# Altium schematic sheet HDMI_Input.SchDoc: LVDS<>SPI Interface
size Letter; Revision: 1; SheetNumber: 2; SheetTotal: 3; Client: Facebook; LeaflabsProject: Sawyer
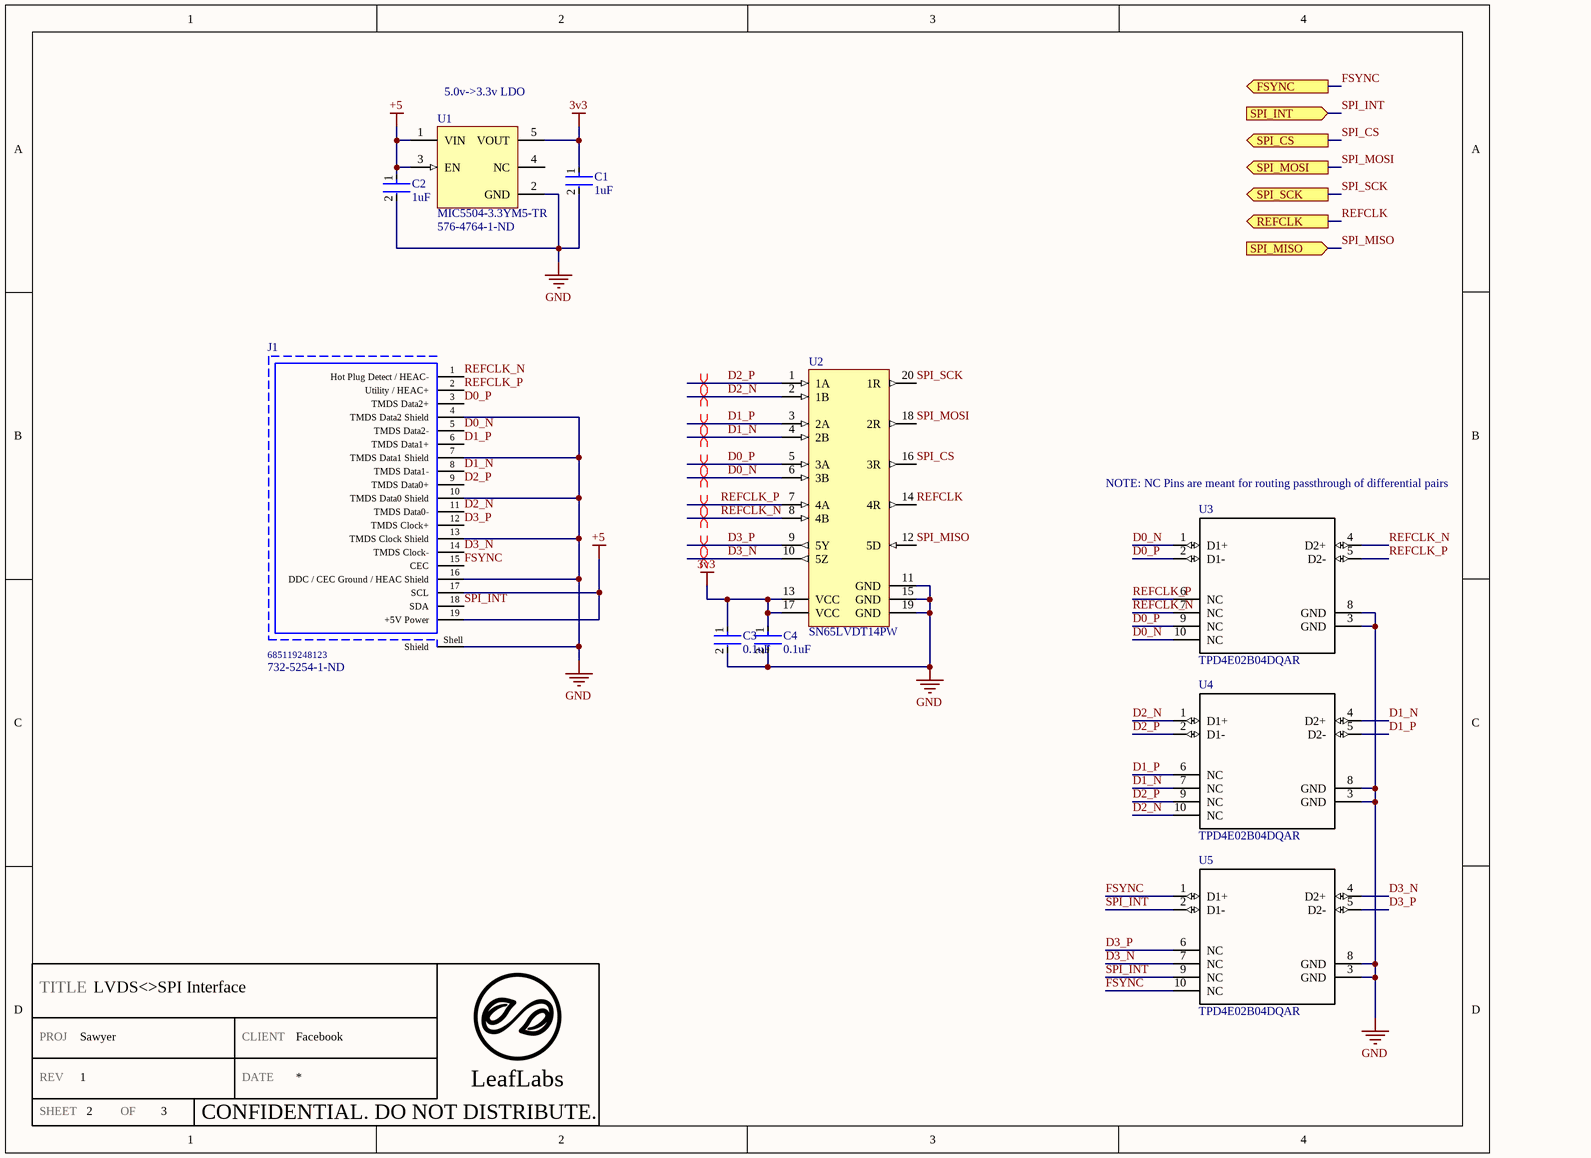
[diagram p0: HDMI_Input.SchDoc]

## Parts
C1  1uF  [FP-CC0603-DA-IPC_B]
C2  1uF  [FP-CC0603-DA-IPC_B]
C3  0.1uF  [FP-CC0603-DA-IPC_C]
C4  0.1uF  [FP-CC0603-DA-IPC_C]
J1  685119248123  Supplier Part Number 1: 732-5254-1-ND  [685119248123]
U1  MIC5504-3.3YM5-TR  Supplier Part Number 1: 576-4764-1-ND  [SOT-23-M5_V]
U2  SN65LVDT14PW  [PW0020A_L]
U3  TPD4E02B04DQAR  [DQA0010A]
U4  TPD4E02B04DQAR  [DQA0010A]
U5  TPD4E02B04DQAR  [DQA0010A]

## Ports
FSYNC (out), REFCLK (out), SPI_CS (out), SPI_INT (in), SPI_MISO (in), SPI_MOSI (out), SPI_SCK (out)

## Nets
3v3: C1.1 C3.1 C4.1 U1.5(VOUT) U2.13(VCC) U2.17(VCC)
+5: C2.1 J1.17(SCL) J1.19(+5V_Power) U1.1(VIN) U1.3(EN)
GND: C1.2 C2.2 C3.2 C4.2 J1.4(TMDS_Data2_Shield) J1.7(TMDS_Data1_Shield) J1.10(TMDS_Data0_Shield) J1.13(TMDS_Clock_Shield) J1.16(DDC_/_CEC_Ground_/_HEAC_Shield) J1.Shell(Shield) U1.2(GND) U2.11(GND) U2.15(GND) U2.19(GND) U3.3(GND) U3.8(GND) U4.3(GND) U4.8(GND) U5.3(GND) U5.8(GND)
D0_N: J1.5(TMDS_Data2-) U2.6(3B) U3.1(D1+) U3.10(NC)
D0_P: J1.3(TMDS_Data2+) U2.5(3A) U3.2(D1-) U3.9(NC)
D1_N: J1.8(TMDS_Data1-) U2.4(2B) U4.4(D2+) U4.7(NC)
D1_P: J1.6(TMDS_Data1+) U2.3(2A) U4.5(D2-) U4.6(NC)
D2_N: J1.11(TMDS_Data0-) U2.2(1B) U4.1(D1+) U4.10(NC)
D2_P: J1.9(TMDS_Data0+) U2.1(1A) U4.2(D1-) U4.9(NC)
D3_N: J1.14(TMDS_Clock-) U2.10(5Z) U5.4(D2+) U5.7(NC)
D3_P: J1.12(TMDS_Clock+) U2.9(5Y) U5.5(D2-) U5.6(NC)
FSYNC: J1.15(CEC) U5.1(D1+) U5.10(NC) ; port FSYNC
REFCLK: U2.14(4R) ; port REFCLK
REFCLK_N: J1.1(Hot_Plug_Detect_/_HEAC-) U2.8(4B) U3.4(D2+) U3.7(NC)
REFCLK_P: J1.2(Utility_/_HEAC+) U2.7(4A) U3.5(D2-) U3.6(NC)
SPI_CS: U2.16(3R) ; port SPI_CS
SPI_INT: J1.18(SDA) U5.2(D1-) U5.9(NC) ; port SPI_INT
SPI_MISO: U2.12(5D) ; port SPI_MISO
SPI_MOSI: U2.18(2R) ; port SPI_MOSI
SPI_SCK: U2.20(1R) ; port SPI_SCK

Not connected (* = marked no-connect by the designer): U1 4(NC)

## Layout directives
differential pair: D0_N, D0_P, D1_N, D1_P, D2_N, D2_P, D3_N, D3_P, REFCLK_N, REFCLK_P

## Notes on the sheet
- (near U1) 5.0v->3.3v LDO
- NOTE: NC Pins are meant for routing passthrough of differential pairs
- PROJ
- TITLE
- CLIENT
- REV
- DATE
- LeafLabs
- SHEET
- OF
- CONFIDENTIAL. DO NOT DISTRIBUTE.

## Library data of the parts
C1 C2 = CAP-0603-1uF: CAP CER 1UF X7R 0603; ComponentLink2Description: Datasheet; Device Class L2: Capacitors; ComponentLink2URL: http://www.yageo.com/documents/recent/UPY-GPHC_X7R_6.3V-to-50V_18.pdf; Category: Cap; Supplier 1: Digi-Key; Supplier Part Number 1: 1276-1036-1-ND
C3 C4 = CAP-0603-0.1uF: CAP CER 0.1UF 16V X7R 0603; Manufacturer Part Number: CC0603KRX7R7BB104; Manufacturer: YAGEO; Tolerance: 0.1; Value: 100 nF; Temperature Coefficient: 15%; Material: Ceramic; Voltage Rating: 16 V; Package: CC0603-DA; ComponentLink2Description: Datasheet; Octopart: https://octopart.com/cc0603krx7r7bb104-yageo-192941; Temperature Range High: +125°C; Digikey Description: CAP CER 0.1UF 16V X7R 0603; Voltage: 16 V; Device Class L2: Capacitors; Height: 0.9mm; Temperature: -55°C to +125°C; Device Class L1: Passive Components; Device Class L3: Ceramic Capacitors; ComponentLink2URL: http://www.yageo.com/documents/recent/UPY-GPHC_X7R_6.3V-to-50V_18.pdf; Footprint Url: http://www.yageo.com/exep/pages/download/literatures/UPY-C_GEN_24.pdf; RoHS: TRUE; Temperature Range Low: -55°C; Temperature Characteristic: X7R; Lead Free: Yes; Capacitance: 100 nF; Category: Cap; Mouser Description: Multilayer Ceramic Capacitor, CC Series, 0.1 - F, - 10%, X7R, 16 V, 0603 [1608 Metric]; Automotive: No; Supplier 1: Digi-Key; Supplier Part Number 1: 311-1088-1-ND
J1 = 685119248123: Micro HDMI Type D Receptacle WR-COM, Horizontal, SMT; Manufacturer: Wurth Elektronik; Contact Resistance: 10mOhm; Working Voltage: 40VAC; Rated Current: 0.5A; Publisher: WurthElektronik; Part Number: 685119248123; Packaging: TapeandReel; Gender: Receptacle; Datasheet URL: https://katalog.we-online.de/em/datasheet/685119248123.pdf; Mounting Technology: SMT; Package Reference: 685119248123; Manufacturer URL: http://www.we-online.de; Orientation: Horizontal; Operating Temperature: -40to85degC; Connector Type: MicroHDMITypeD; Supplier 1: Digi-Key
U1 = MIC5504-3.3YM5-TR: Single LDO, 2.5 to 5.5 V, Fixed Out 3.3 V, 0.3 A, -40 to 125 degC, 5-Pin SOT-23 (M5), RoHS, Tape and Reel; Manufacturer: Microchip; Number of Regulators: 1; Dropout Voltage: 160mV; Output Current: 300mA; Min Input Voltage: 2.5V; Nominal Output Voltage: 3.3V; Max Input Voltage: 5.5V; Min Current Limit: 400mA; Number of Pins: 5; RoHSCompliant: True; Min Operating Temperature: -40degC; Case\/Package: SOT-23; Datasheet URL: http://ww1.microchip.com/downloads/en/DeviceDoc/MIC550X.pdf; Package Description: 5-Pin Small Outline Transistor, Body 1.6 x 2.9 mm, Pitch 0.95 mm; Max Operating Temperature: 125degC; Packaging: CutTape; Manufacturer URL: http://www.microchip.com/; Package Reference: SOT-23; Mount: SurfaceMount; Output Voltage: 3.3V; Mounting Technology: SurfaceMount; Lead Free: LeadFree; REACH SVHC: NoSVHC; Datasheet Version: Rev. 2.3, 04/2015; Supplier 1: Digi-Key
U2 = SN65LVDT14PW: SPI<>LVDS Transceiver, 1 Tx and 4 Rx, -55 to +125 degC, 20-pin TSSOP (PW), Green (RoHS & no Sb/Br); Part-to-Part Skew(Max)(ps): 1000; Manufacturer: Texas Instruments; No. of Tx: 1; ESD HBM(kV): 12; ICC(Max)(mA): 25; Signaling Rate(Mbps): 125; Output Signal: LVDS, LVTTL; SubFamily: LVDS PHY (<800Mbps); No. of Rx: 4; PackageVersion: revG, Feb-2011; ComponentLink1Description: Manufacturer URL; PackageReference: PW0020A; DatasheetVersion: SCES633; ComponentLink2URL: http://www.ti.com/general/docs/lit/getliterature.tsp?genericPartNumber=SN65LVDT14-EP&fileType=pdf; ComponentLink2Description: Datasheet; ComponentLink1URL: http://www.ti.com/; Eco-Plan: Green (RoHS & no Sb/Br); ComponentLink3Description: URL Link1; PackageDescription: 20-Pin Plastic Thin Small Outline Package 6.5 x 4.4 mm Body ,0.65 mm Pitch; ComponentLink3URL: SamplesURL:http://www.ti.com/product/sn65lvdt14-ep#samples; Mounting Technology: Surface Mount; PartNumber: SN65LVDT14PW; Input Signal: LVDS, LVTTL; Supplier 1: Digi-Key; Supplier Part Number 1: 296-12736-5-ND
U3-U5 = TPD4E02B04DQAR: 4 Channel TVS Avalanch diode for USB3/HDMI2.0 protection; Manufacturer: Texas Instruments; CompType: IC; PIN_COUNT: 10; Application_BuildNumber: *; PartNumber: TPD4E02B04DQAR; PackageReference: DQA0010A; MountType: SMT; RoHS: Y; RefDes: RefDes; Type: DEV; Value: Value; Copyright: Copyright (C) 2018 Accelerated Designs. All rights reserved; Part Number: TPD4E02B04DQAR; Supplier 1: Digi-Key; Supplier Part Number 1: 296-43875-1-ND